# Altium schematic sheet Top.SchDoc
size A
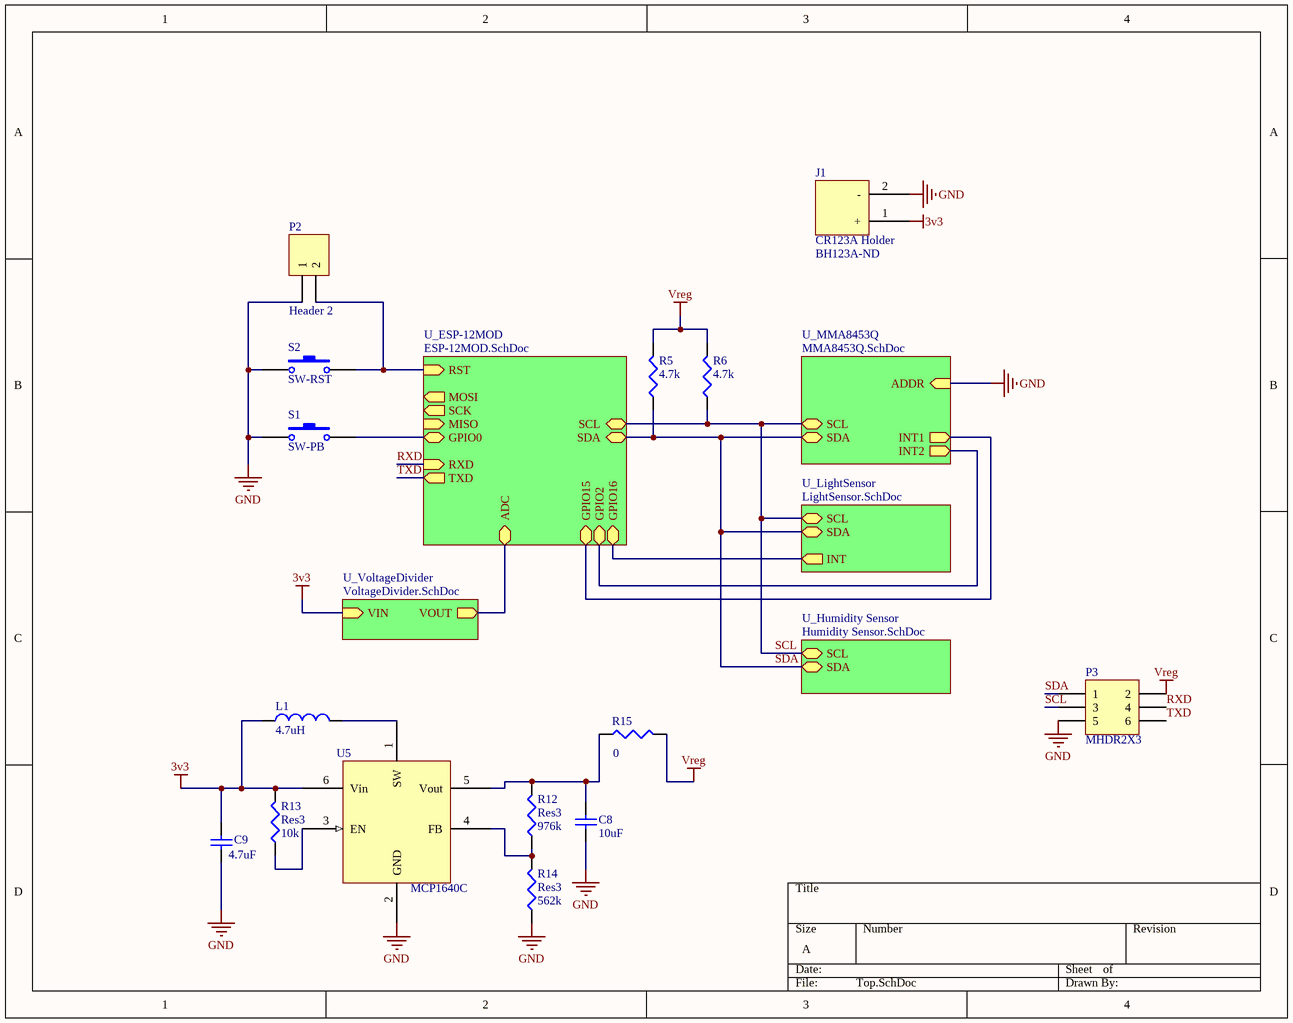
[diagram p0: Top.SchDoc]

## Parts
C8  value 10uF  [C0805]  (hidden comment: Cap)
C9  value 4.7uF  [C0805]  (hidden comment: Cap)
J1  CR123A Holder  Supplier Part Number 1: BH123A-ND  [BHA123A]
L1  value 4.7uH  [6.3mmx6.3mm Inductor]  (hidden comment: Inductor)
P2  Header 2  [HDR1X2]
P3  MHDR2X3  [MHDR2X3]
R5  value 4.7k  [J1-0603]  (hidden comment: Res3)
R6  value 4.7k  [J1-0603]  (hidden comment: Res3)
R12  Res3  value 976k  [J1-0603]
R13  Res3  value 10k  [J1-0603]
R14  Res3  value 562k  [J1-0603]
R15  value 0  [J1-0603]  (hidden comment: Res3)
S1  SW-PB  [SMD SPST Tactile Switch]
S2  SW-RST  [SMD SPST Tactile Switch]
U5  MCP1640C  [SOT-23 MCP1640]

## Sub-sheets
U_ESP-12MOD = ESP-12MOD.SchDoc: RST (in), RXD (in), TXD (out), ADC (bidir), SCL (bidir), SDA (bidir), SCK (out), MISO (in), MOSI (out), GPIO16 (bidir), GPIO2 (bidir), GPIO15 (bidir), GPIO0 (bidir)
U_Humidity Sensor = Humidity Sensor.SchDoc: SDA (bidir), SCL (bidir)
U_LightSensor = LightSensor.SchDoc: SCL (bidir), SDA (bidir), INT (out)
U_MMA8453Q = MMA8453Q.SchDoc: SCL (bidir), SDA (bidir), ADDR (in), INT1 (out), INT2 (out)
U_VoltageDivider = VoltageDivider.SchDoc: VIN (in), VOUT (out)

## Nets
3v3: C9.2 J1.1(+) L1.1 R13.2 U5.6(Vin) ; sheet U_VoltageDivider/VIN
GND: C8.1 C9.1 J1.2(-) P2.1 P3.5 R14.1 S1.1 S2.1 U5.2(GND) ; sheet U_MMA8453Q/ADDR
Vreg: P3.2 R5.2 R6.2 R15.2
RXD: P3.4 ; sheet U_ESP-12MOD/RXD
SCL: P3.3 R6.1 ; sheet U_MMA8453Q/SCL, sheet U_LightSensor/SCL, sheet U_ESP-12MOD/SCL, sheet U_Humidity Sensor/SCL
SDA: P3.1 R5.1 ; sheet U_MMA8453Q/SDA, sheet U_LightSensor/SDA, sheet U_ESP-12MOD/SDA, sheet U_Humidity Sensor/SDA
TXD: P3.6 ; sheet U_ESP-12MOD/TXD
NetC8_2: C8.2 R12.2 R15.1 U5.5(Vout)
NetL1_2: L1.2 U5.1(SW)
NetP2_2: P2.2 S2.2 ; sheet U_ESP-12MOD/RST
NetR12_1: R12.1 R14.2 U5.4(FB)
NetR13_1: R13.1 U5.3(EN)
NetS1_2: S1.2 ; sheet U_ESP-12MOD/GPIO0
(unnamed): sheet U_MMA8453Q/INT1, sheet U_ESP-12MOD/GPIO15
(unnamed): sheet U_MMA8453Q/INT2, sheet U_ESP-12MOD/GPIO2
(unnamed): sheet U_LightSensor/INT, sheet U_ESP-12MOD/GPIO16
(unnamed): sheet U_ESP-12MOD/ADC, sheet U_VoltageDivider/VOUT

## Library data of the parts
C8 C9 = Cap: Capacitor; Published: 8-Jun-2000; LatestRevisionDate: 17-Jul-2002; LatestRevisionNote: Re-released for DXP Platform.; PackageReference: RAD-0.3; Publisher: Altium Limited; PackageDescription: Radial Cap, Thru-Hole; 2 Leads; 0.3 in Pin Spacing; Supplier 1: Digi-Key
  C8: Supplier Part Number 1: 587-1312-1-ND
  C9: Supplier Part Number 1: 311-1371-1-ND
L1 = Inductor: Code_IEC: 1005; Published: 8-Jun-2000; LatestRevisionDate: 29-May-2009; LatestRevisionNote: IPC-7351 Footprint Added.; PackageReference: 0402-A; Publisher: Altium Limited; PackageDescription: Chip Inductor; Code_JEITA: 0402; Supplier 1: Digi-Key; Supplier Part Number 1: 495-1997-1-ND
P2 = Header 2: Header, 2-Pin; LatestRevisionDate: 17-Jul-2002; LatestRevisionNote: Re-released for DXP Platform.; Publisher: Altium Limited
P3 = MHDR2X3: Header, 3-Pin, Dual row; LatestRevisionDate: 17-Jul-2002; LatestRevisionNote: Re-released for DXP Platform.; Publisher: Altium Limited
R5 R6 R12-R15 = Res3: Resistor; Published: 8-Jun-2000; LatestRevisionDate: 29-May-2009; LatestRevisionNote: IPC-7351 Footprint Added.; PackageReference: J1-0603; Publisher: Altium Limited; PackageDescription: Chip Resistor
S1 S2 = SW-PB: Switch; pin to pad: 2>3; Published: 24-Mar-1999; LatestRevisionDate: 17-Jul-2002; LatestRevisionNote: Re-released for DXP Platform.; PackageReference: SPST-2; Publisher: Altium Limited; PackageDescription: Switch; 2 Leads; Supplier 1: Digi-Key; Supplier Part Number 1: CKN9112CT-ND
U5 = MCP1640C: Synchronous Boost converter 100mA; Supplier 1: Digi-Key; Supplier Part Number 1: MCP1640CT-I/CHYDKR-ND
J1 = CR123A Holder: Supplier 1: Digi-Key